# Altium schematic sheet MCU.SchDoc
size Letter; DocumentNumber: 5; SheetNumber: 5; SheetTotal: 7
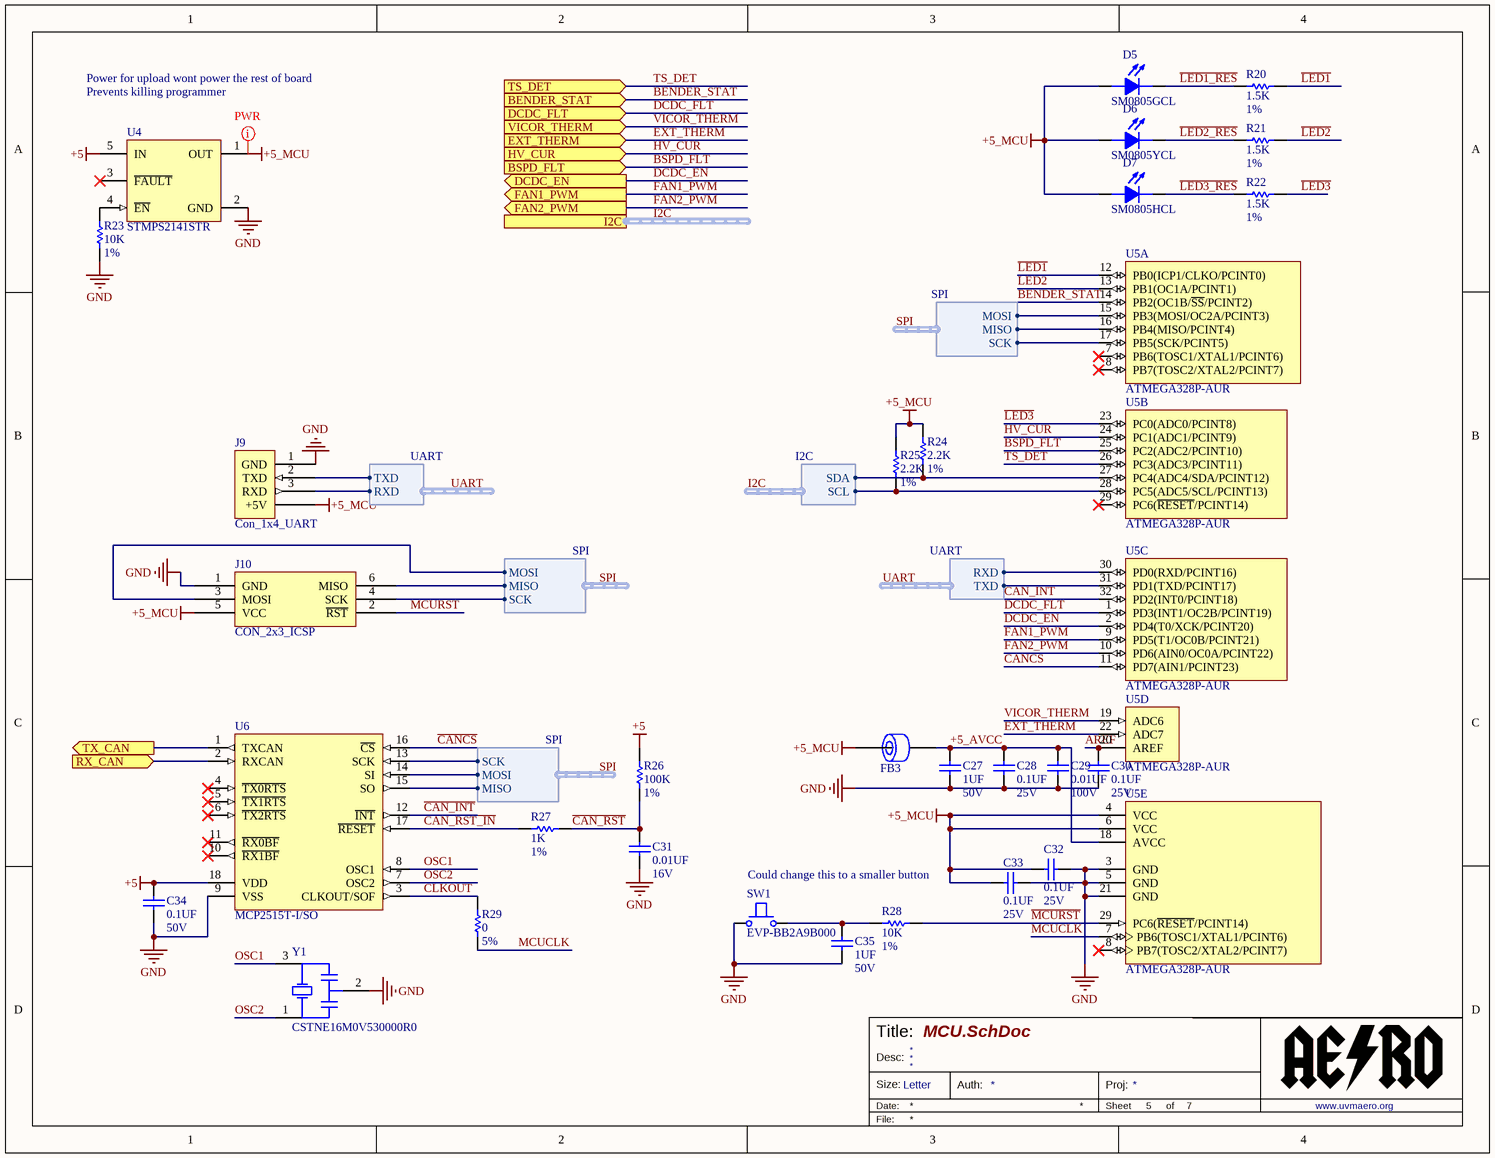
[diagram p0: MCU.SchDoc]

## Parts
C27  Val: 1UF  Vol: 50V  [0603_CAP]  (hidden comment: CAP 0603 1UF 50V 10% X7R)
C28  Val: 0.1UF  Vol: 25V  [0603_CAP]  (hidden comment: CAP 0603 0.1UF 25V 10% X7R)
C29  Val: 0.01UF  Vol: 100V  [0603_CAP]  (hidden comment: CAP 0603 0.01UF 100V 10% X7R)
C30  Val: 0.1UF  Vol: 25V  [0603_CAP]  (hidden comment: CAP 0603 0.1UF 25V 10% X7R)
C31  Val: 0.01UF  Vol: 16V  [0603_CAP]  (hidden comment: CAP 0603 0.01UF 16V 10% X7R)
C32  Val: 0.1UF  Vol: 25V  [0603_CAP]  (hidden comment: CAP 0603 0.1UF 25V 10% X7R)
C33  Val: 0.1UF  Vol: 25V  [0603_CAP]  (hidden comment: CAP 0603 0.1UF 25V 10% X7R)
C34  Val: 0.1UF  Vol: 50V  [0603_CAP]  (hidden comment: CAP 0603 0.1UF 50V 10% X7R)
C35  Val: 1UF  Vol: 50V  [0603_CAP]  (hidden comment: CAP 0603 1UF 50V 10% X7R)
D5  SM0805GCL  [LEDC2012X135N_SM0805GCL(Primary)]
D6  SM0805YCL  [LEDC2012X135N_SM0805YCL(Primary)]
D7  SM0805HCL  [LEDC2012X135N_SM0805HCL(Primary)]
FB3  Ferrite Chip 2500 Ohms  [0603]  (value not drawn)
J9  Con_1x4_UART  [Con 1x4 UART]
J10  CON_2x3_ICSP  [CON_2x3_ICSP]
R20  Val: 1.5K  Tol: 1%  [0603_RES]  (hidden comment: RES 0603 1.5K 1%)
R21  Val: 1.5K  Tol: 1%  [0603_RES]  (hidden comment: RES 0603 1.5K 1%)
R22  Val: 1.5K  Tol: 1%  [0603_RES]  (hidden comment: RES 0603 1.5K 1%)
R23  Val: 10K  Tol: 1%  [0603_RES]  (hidden comment: RES 0603 10K 1%)
R24  Val: 2.2K  Tol: 1%  [0603_RES]  (hidden comment: RES 0603 2.2K 1%)
R25  Val: 2.2K  Tol: 1%  [0603_RES]  (hidden comment: RES 0603 2.2K 1%)
R26  Val: 100K  Tol: 1%  [0603_RES]  (hidden comment: RES 0603 100K 1%)
R27  Val: 1K  Tol: 1%  [0603_RES]  (hidden comment: RES 0603 1K 1%)
R28  Val: 10K  Tol: 1%  [0603_RES]  (hidden comment: RES 0603 10K 1%)
R29  Val: 0  Tol: 5%  [0603_RES]  (hidden comment: RES 0603 0 5%)
SW1  EVP-BB2A9B000  [EVP-BB2A9B000]
U4  STMPS2141STR  [SOT95P280X145-5N]
U5  ATMEGA328P-AUR  [TQFP80P900X900X120-32N]  (parts A,B,C,D,E of 5)
U6  MCP2515T-I/SO  [SOIC-18]
Y1  CSTNE16M0V530000R0  [MURA-CSTCE_G_A-3_V]

## Ports
BENDER_STAT (in), BSPD_FLT (in), DCDC_EN (out), DCDC_FLT (in), EXT_THERM (in), FAN1_PWM (out), FAN2_PWM (out), HV_CUR (in), I2C (harness I2C), RX_CAN (in), TS_DET (in), TX_CAN (out), VICOR_THERM (in)

## Harnesses
I2C: SCL, SDA
SPI: MOSI, MISO, SCK
UART: RXD, TXD

## Nets
+5: C34.2 R26.2 U4.5(IN) U6.18(VDD)
+5_MCU: C32.1 C33.1 D5.A D6.A D7.A FB3.1 J9.4(+5V) J10.5(VCC) R24.2 R25.2 U4.1(OUT) U5.4(VCC) U5.6(VCC)
GND: C27.1 C28.1 C29.1 C30.1 C31.1 C32.2 C33.2 C34.1 C35.1 J9.1(GND) J10.1(GND) R23.1 SW1.A U4.2(GND) U5.3(GND) U5.5(GND) U5.21(GND) U6.9(VSS) Y1.2(GND)
+5_AVCC: C27.2 C28.2 C29.2 FB3.2 U5.18(AVCC)
~{CAN_INT}: U5.32(PD2(INT0/PCINT18)) U6.12(~{INT})
~{CAN_RST}: C31.2 R26.1 R27.2
~{CAN_RST_IN}: R27.1 U6.17(~{RESET})
~{CANCS}: U5.11(PD7(AIN1/PCINT23)) U6.16(~{CS})
~{LED1}: R20.2 U5.12(PB0(ICP1/CLKO/PCINT0))
~{LED1_RES}: D5.C R20.1
~{LED2}: R21.2 U5.13(PB1(OC1A/PCINT1))
~{LED2_RES}: D6.C R21.1
~{LED3}: R22.2 U5.23(PC0(ADC0/PCINT8))
~{LED3_RES}: D7.C R22.1
~{MCURST}: J10.2(~{RST}) R28.1 U5.29(PC6(~{RESET}/PCINT14))
AREF: C30.2 U5.20(AREF)
BENDER_STAT: U5.14(PB2(OC1B/~{SS}/PCINT2)) ; port BENDER_STAT
BSPD_FLT: U5.25(PC2(ADC2/PCINT10)) ; port BSPD_FLT
CLKOUT: R29.1 U6.3(CLKOUT/SOF)
DCDC_EN: U5.2(PD4(T0/XCK/PCINT20)) ; port DCDC_EN
DCDC_FLT: U5.1(PD3(INT1/OC2B/PCINT19)) ; port DCDC_FLT
EXT_THERM: U5.22(ADC7) ; port EXT_THERM
FAN1_PWM: U5.9(PD5(T1/OC0B/PCINT21)) ; port FAN1_PWM
FAN2_PWM: U5.10(PD6(AIN0/OC0A/PCINT22)) ; port FAN2_PWM
HV_CUR: U5.24(PC1(ADC1/PCINT9)) ; port HV_CUR
I2C.SCL: R25.1 U5.28(PC5(ADC5/SCL/PCINT13)) ; port I2C.SCL
I2C.SDA: R24.1 U5.27(PC4(ADC4/SDA/PCINT12)) ; port I2C.SDA
MCUCLK: R29.2 U5.7(PB6(TOSC1/XTAL1/PCINT6))
OSC1: U6.8(OSC1) Y1.3(X2)
OSC2: U6.7(OSC2) Y1.1(X1)
RX_CAN: U6.2(RXCAN) ; port RX_CAN
SPI.MISO: J10.6(MISO) U5.16(PB4(MISO/PCINT4)) U6.15(SO) ; harness SPI.MISO
SPI.MOSI: J10.3(MOSI) U5.15(PB3(MOSI/OC2A/PCINT3)) U6.14(SI) ; harness SPI.MOSI
SPI.SCK: J10.4(SCK) U5.17(PB5(SCK/PCINT5)) U6.13(SCK) ; harness SPI.SCK
TS_DET: U5.26(PC3(ADC3/PCINT11)) ; port TS_DET
TX_CAN: U6.1(TXCAN) ; port TX_CAN
UART.RXD: J9.3(RXD) U5.30(PD0(RXD/PCINT16)) ; harness UART.RXD
UART.TXD: J9.2(TXD) U5.31(PD1(TXD/PCINT17)) ; harness UART.TXD
VICOR_THERM: U5.19(ADC6) ; port VICOR_THERM
NetC35_2: C35.2 R28.2 SW1.B
NetR23_2: R23.2 U4.4(~{EN})

Not connected (* = marked no-connect by the designer): U4 3(~{FAULT})*; U5 8(PB7(TOSC2/XTAL2/PCINT7))*; U6 4(~{TX0RTS})* 5(~{TX1RTS})* 6(~{TX2RTS})* 10(~{RX1BF})* 11(~{RX0BF})*

## Buses and harness runs
harness I2C = port I2C

## Layout directives
net class PWR; net class PWR_RAIL: +5_MCU

## Notes on the sheet
- Power for upload wont power the rest of board
- Prevents killing programmer
- Could change this to a smaller button
- Title:
- Size:
- Date:
- Desc:
- Letter
- Auth:
- Sheet
- Proj:
- *
- of
- www.uvmaero.org
- File:

## Library data of the parts
C27 C35 = CAP 0603 1UF 50V 10% X7R: Capacitor Surface Mount 0603 Footprint 1UF 50V 10% Tolerance Ceramic X7R; Manufacturer: Various; PCB Package: 0603; Description in Visual: Cap SMT 0603 1UF 50V 10% Ceramic X7R; P/N: CAP 0603 1UF 50V 10% X7R; Manufacturer P/N: Various; Value: 1UF; Voltage: 50V; Tolerance: 10%; Type: Ceramic X7R; ComponentLink1Description: Manufacturer Website; ComponentLink2Description: Component Datasheet; ComponentLink3Description: Octopart Link
C28 C30 C32 C33 = CAP 0603 0.1UF 25V 10% X7R: Capacitor Surface Mount 0603 Footprint 0.1UF 25V 10% Tolerance Ceramic X7R; Manufacturer: Various; PCB Package: 0603; Description in Visual: Cap SMT 0603 0.1UF 25V 10%  Cer X7R; P/N: CAP 0603 0.1UF 25V 10% X7R; Manufacturer P/N: Various; Value: 0.1UF; Voltage: 25V; Tolerance: 10%; Type: Ceramic X7R; ComponentLink1Description: Manufacturer Website; ComponentLink2Description: Component Datasheet; ComponentLink3Description: Octopart Link
C29 = CAP 0603 0.01UF 100V 10% X7R: Capacitor Surface Mount 0603 Footprint 0.01UF 100V 10% Tolerance Ceramic X7R; Manufacturer: Various; PCB Package: 0603; Description in Visual: Cap SMT 0603 0.01UF 100V 10%  Cer X7R; P/N: CAP 0603 0.01UF 100V 10% X7R; Manufacturer P/N: Various; Value: 0.01UF; Voltage: 100V; Tolerance: 10%; Type: Ceramic X7R; ComponentLink1Description: Manufacturer Website; ComponentLink2Description: Component Datasheet; ComponentLink3Description: Octopart Link
C31 = CAP 0603 0.01UF 16V 10% X7R: Capacitor Surface Mount 0603 Footprint 0.01UF 16V 10% Tolerance Ceramic X7R; Manufacturer: Various; PCB Package: 0603; Description in Visual: Cap SMT 0603 0.01UF 16V 10%  Cer X7R; P/N: CAP 0603 0.01UF 16V 10% X7R; Manufacturer P/N: Various; Value: 0.01UF; Voltage: 16V; Tolerance: 10%; Type: Ceramic X7R; ComponentLink1Description: Manufacturer Website; ComponentLink2Description: Component Datasheet; ComponentLink3Description: Octopart Link
C34 = CAP 0603 0.1UF 50V 10% X7R: Capacitor Surface Mount 0603 Footprint 0.1UF 50V 10% Tolerance Ceramic X7R; Manufacturer: Various; PCB Package: 0603; Description in Visual: Cap SMT 0603 0.1UF 50V 10%  Cer X7R; P/N: CAP 0603 0.1UF 50V 10% X7R; Manufacturer P/N: Various; Value: 0.1UF; Voltage: 50V; Tolerance: 10%; Type: Ceramic X7R; ComponentLink1Description: Manufacturer Website; ComponentLink2Description: Component Datasheet; ComponentLink3Description: Octopart Link
D5 = SM0805GCL: Green 574nm LED Indication - Discrete 1.9V 0805 (2012 Metric); Manufacturer: Bivar; Forward Current: 2mA; Lens Color: Colorless; Lens Transparency: Clear; Luminous Intensity: 3.6mcd; Viewing Angle: 130°; Supplier 1: Digi-Key; Supplier Part Number 1: 492-2525-1-ND; Case Code (Imperial): 0805; Case Code (Metric): 2012; Case/Package: 0805; Category: LEDs; Color: Green; Dominant Wavelength: 574nm; Forward Voltage: 1.9V; Height: 0.8mm; Illumination Color: Green; Lead Free: Lead Free; Length: 2mm; Manufacturer Part Number: SM0805GCL; Max Operating Temperature: 80°C; Min Operating Temperature: -30°C; Mount: Surface Mount; Package Quantity: 4000; Packaging: Tape and Reel; Test Current: 2mA; Width: 1.2mm
D6 = SM0805YCL: Yellow 592nm LED Indication - Discrete 1.9V 0805 (2012 Metric); Manufacturer: Bivar; Forward Current: 2mA; Lens Color: Colorless; Lens Transparency: Clear; Luminous Intensity: 11.5mcd; Viewing Angle: 130°; Case Code (Imperial): 0805; Case Code (Metric): 2012; Case/Package: 0805; Category: LEDs; Color: Yellow; Dominant Wavelength: 592nm; Forward Voltage: 1.9V; Height: 0.8mm; Illumination Color: Yellow; Lead Free: Lead Free; Length: 2mm; Manufacturer Part Number: SM0805YCL; Max Operating Temperature: 80°C; Min Operating Temperature: -30°C; Mount: Surface Mount; Package Quantity: 4000; Packaging: Tape and Reel; Test Current: 2mA; Width: 1.2mm; Supplier 1: Digi-Key; Supplier Part Number 1: 492-2526-1-ND
D7 = SM0805HCL: Red 631nm LED Indication - Discrete 1.9V 0805 (2012 Metric); Manufacturer: Bivar; Forward Current: 2mA; Lens Color: Colorless; Lens Transparency: Clear; Luminous Intensity: 11.5mcd; Power Rating: 78mW; Viewing Angle: 130°; Supplier 1: Digi-Key; Supplier Part Number 1: 492-2281-1-ND; Width: 1.2mm; Case Code (Imperial): 0805; Case Code (Metric): 2012; Case/Package: 0805; Category: LEDs; Color: Red; Dominant Wavelength: 631nm; Forward Voltage: 1.9V; Height: 0.8mm; Illumination Color: Red; Lead Free: Lead Free; Length: 2mm; Manufacturer Part Number: SM0805HCL; Max Operating Temperature: 80°C; Min Operating Temperature: -30°C; Mount: Surface Mount; Package Quantity: 4000; Packaging: Tape and Reel; Test Current: 2mA
FB3 = MMZ1608A252B: Ferrite Chip 200 mA 2500 Ohms Differential Mode - Single 0603 Footprint; Manufacturer: TDK; Description in Visual: Ferrite SMT 200mA 2500Ohm Dif Mode 0603; Usage: Signal Line; Current (mA): 200; Frequency: 100 MHz; Impedance at Freq (ohms): 2500; DC Resistance (ohms): 0.8; P/N: MMZ1608A252B; Manufacturer P/N: MMZ1608A252B; Filter type: Differential Mode - Single; Operating Temperature Range: -55 to +125 °C; PCB Package: 0603; ComponentLink1Description: Manufacturer Website; ComponentLink1URL: http://www.tdk.com/; ComponentLink2Description: Component Datasheet; ComponentLink2URL: http://www.tdk.co.jp/tefe02/e9412_mmz1608.pdf; ComponentLink3Description: Octopart Link; ComponentLink3URL: http://octopart.com/partsearch/#search/requestData&q=MMZ1608A252B
J9 = Con_1x4_UART: Connector Header Through Hole 4 position 0.100" (2.54mm); Manufacturer: Wurth Electronics; Manufacturer Part Number: 61300411121; Connector Type: Male Pin; Gender: Male; Number of Contacts: 4; Pitch: 0.1inch; Supplier Part Number 1: 732-5317-ND; Supplier Part Number 2: H123038-ND; Category: Connectors; Color: Black; Contact Material: Copper; Contact Mating Length: 0.236inch; Contact Plating: Gold; Lead Free: Lead Free; Mount: Through Hole; Number of Positions: 4; Number of Rows: 1; Packaging: Bulk; REACH SVHC: Unknown; Termination: Solder; Supplier 1: Digi-Key; Supplier 2: Digi-Key
J10 = CON_2x3_ICSP: Connector Header Through Hole 6 position 0.100" (2.54mm) for AVR ICSP; Supplier 1: Digi-Key; Supplier 2: Digi-Key; Supplier 3: Allied Electronics; Supplier 4: Digi-Key; Supplier Part Number 1: 732-5295-ND; Supplier Part Number 2: 952-2120-ND; Supplier Part Number 3: 70949531; Supplier Part Number 4: S2011EC-03-ND
R20-R22 = RES 0603 1.5K 1%: Resistor Surface Mount, 1.5K Ohms, 0603 Footprint, 1% Tolerance 0.1W; Manufacturer: Various; PCB Package: 0603; Description in Visual: Res SMT 1.5K 0603  1%  0.1W; P/N: RES 0603 1.5K 1%; Manufacturer P/N: Various; Value: 1.5K; Power_Rating: 0.1W; Tolerance: 1%
R23 R28 = RES 0603 10K 1%: Resistor Surface Mount, 10K Ohms, 0603 Footprint, 1% Tolerance 0.1W; Manufacturer: Various; PCB Package: 0603; Description in Visual: Res SMT 10K 0603  1%  0.1W; P/N: RES 0603 10K 1%; Manufacturer P/N: Various; Value: 10K; Power_Rating: 0.1W; Tolerance: 1%
R24 R25 = RES 0603 2.2K 1%: Resistor Surface Mount, 2.2K Ohms, 0603 Footprint, 1% Tolerance 0.1W; Manufacturer: Various; PCB Package: 0603; Description in Visual: Res SMT 2.2K 0603  1%  0.1W; P/N: RES 0603 2.2K 1%; Manufacturer P/N: Various; Value: 2.2K; Power_Rating: 0.1W; Tolerance: 1%
R26 = RES 0603 100K 1%: Resistor Surface Mount, 100K Ohms, 0603 Footprint, 1% Tolerance 0.1W; Manufacturer: Various; PCB Package: 0603; Description in Visual: Res SMT 100K 0603  1%  0.1W; P/N: RES 0603 100K 1%; Manufacturer P/N: Various; Value: 100K; Power_Rating: 0.1W; Tolerance: 1%
R27 = RES 0603 1K 1%: Resistor Surface Mount, 1K Ohms, 0603 Footprint, 1% Tolerance 0.1W; Manufacturer: Various; PCB Package: 0603; Description in Visual: Res SMT 1K 0603  1%  0.1W; P/N: RES 0603 1K 1%; Manufacturer P/N: Various; Value: 1K; Power_Rating: 0.1W; Tolerance: 1%
R29 = RES 0603 0 5%: Resistor Surface Mount, 0 Ohms, 0603 Footprint, 5% Tolerance 0.1W; Manufacturer: Various; PCB Package: 0603; Description in Visual: Res SMT 0 0603  5%  0.1W; Value: 0; P/N: RES 0603 0 5%; Manufacturer P/N: Various; Power_Rating: 0.1W; Tolerance: 5%
SW1 = EVP-BB2A9B000: Tactile Switch SPST-NO Top Actuated Surface Mount; Manufacturer: Panasonic; Actuator Type: Standard; Illumination Type: Non-Illuminated; Mechanical Life: 500000Cycles; Operating Force: 160gf; Switch Function: Off-Mom; Switch Travel: 0.11mm; Throw Configuration: SPST; Supplier 1: Digi-Key; Supplier Part Number 1: P19888CT-ND; Category: Tactile Switches; Lead Free: Lead Free; Manufacturer Part Number: EVP-BB2A9B000; Max Operating Temperature: 85°C; Min Operating Temperature: -40°C; Mount: Surface Mount; Packaging: Tape and Reel; Termination: Gull Wing
U4 = STMPS2141STR: Power Switch/Driver 1:1 N-Channel 500mA SOT-23-5; Manufacturer: STMicroelectronics; Mfg Package Ident: SOT23-5L; Voltage - Load: 2.7 V ~ 5.5 V; Rds On (Typ): 90 mOhm; helpURL: https://upverter.com/upn/revision/bed08d647fcd8b7a/; ComponentLink2Description: Datasheet; Temperature: -40°C to +125°C; Package: SOT23-5L; Supplier 2: Mouser; Price: 0.377534036938; Supplier 1: Digi-Key; ComponentLink1URL: https://upverter.com/upn/revision/bed08d647fcd8b7a/; Supplier Part Number 2: 511-STMPS2141STR; Supplier Part Number 1: 497-6933-1-ND; ComponentLink1Description: Upverter; ComponentLink2URL: http://www.st.com/content/ccc/resource/technical/document/datasheet/e8/d7/48/25/eb/87/45/b3/CD00167470.pdf/files/CD00167470.pdf/jcr:content/translations/en.CD00167470.pdf; RoHS: TRUE; Mouser Part Number: 511-STMPS2141STR; Current - Output (Max): 500mA; Temperature Range High: +125°C; Digikey Description: IC PWR SWITCH 1CH 500MA SOT23-5; Manufacturer Product Page: http://www.st.com/content/st_com/en/products/switches-and-multiplexers/power-load-switches/stmps2141.html; Digikey Part Number: 497-6933-1-ND; Lead Free: yes; Temperature Range Low: -40°C; Part Number: STMPS2141STR
U5 = ATMEGA328P-AUR: AVR AVR® ATmega Microcontroller IC 8-Bit 20MHz 32KB (16K x 16) FLASH 32-TQFP (7x7); Manufacturer: Microchip / Atmel; Data Bus Width: 8b; Interface: I2C,SPI,UART,USART,2-Wire; Max Supply Voltage: 5.5V; Min Supply Voltage: 1.8V; Number of I/Os: 23; Number of Timers/Counters: 3; Oscillator Type: Internal; Peripherals: Brown-out Detect/Reset,POR,PWM,WDT; RAM Size: 2KB; Watchdog Timer: Yes; Supplier 1: Digi-Key; Supplier Part Number 1: ATMEGA328P-AURCT-ND; Case/Package: A; Category: Microcontrollers; Contact Plating: Tin,Matte; Core Architecture: AVR; Frequency: 20MHz; Lead Free: Lead Free; Manufacturer Part Number: ATMEGA328P-AUR; Max Frequency: 20MHz; Max Operating Temperature: 85°C; Memory Size: 32KB; Memory Type: FLASH; Min Operating Temperature: -40°C; Mount: Surface Mount; Number of Pins: 32; Number of Programmable I/O: 23; Package Quantity: 2000; Packaging: Tape and Reel; REACH SVHC: No SVHC
U6 = MCP2515T-I/SO: CANbus Controller CAN 2.0 SPI Interface 18-SOIC; Manufacturer: Microchip; Data Rate: 1Mbps; Interface: SPI,CAN; Max Supply Current: 10mA; Max Supply Voltage: 5.5V; Min Supply Voltage: 2.7V; Number of Drivers: 1; Number of Receive Buffers: 2; Number of Transmit Buffers: 3; Operating Supply Voltage: 5V; RevisionNote: URLs added. DatasheetVersion updated.; ComponentLink1Description: Manufacturer URL; Code_JEDEC: MS-013; ComponentLink2URL: http://ww1.microchip.com/downloads/en/DeviceDoc/21801f.pdf; ComponentLink3Description: Package Specification; PackageVersion: revBB, Aug-2009; PackageReference: SOIC-SO18; ComponentLink2Description: Datasheet; DatasheetVersion: revF, Oct-2010; PackageDescription: 18-Lead Plastic Small Outline (SO) - Wide 7.50mm Body [SOIC]; ComponentLink1URL: http://www.microchip.com/; ComponentLink3URL: http://www.microchip.com/stellent/groups/techpub_sg/documents/packagingspec/en012702.pdf; Case/Package: SOIC; Category: Interface ICs; Lead Free: Lead Free; Manufacturer Part Number: MCP2515T-I/SO; Max Operating Temperature: 85°C; Min Operating Temperature: -40°C; Mount: Surface Mount; Nominal Supply Current: 10mA; Number of Pins: 18; Number of Receivers: 1; Number of Transceivers: 1; Operating Supply Current: 10mA; Package Quantity: 1100; Packaging: Tape and Reel; Radiation Hardening: No; REACH SVHC: No SVHC
Y1 = CSTNE16M0V530000R0: Ceramic Resonator, 8 MHz, +/- 0.5%, -20 to 80 degC, 3-Pin SMD, RoHS, Tape and Reel; Manufacturer: Murata; Capacitance: 15pF; Frequency: 16MHz; Frequency Stability: 0.3%; Impedance: 40R; Packaging: Tape and Reel; Case/Package: SMD/SMT; Composition: Ceramic; Frequency Tolerance: 0.5%; Manufacturer Part Number: CSTNE16M0V530000R0; Max Operating Temperature: 85°C; Min Operating Temperature: -40°C; Mount: Surface Mount; Supplier 1: Digi-Key; Supplier Part Number 1: 490-17948-1-ND